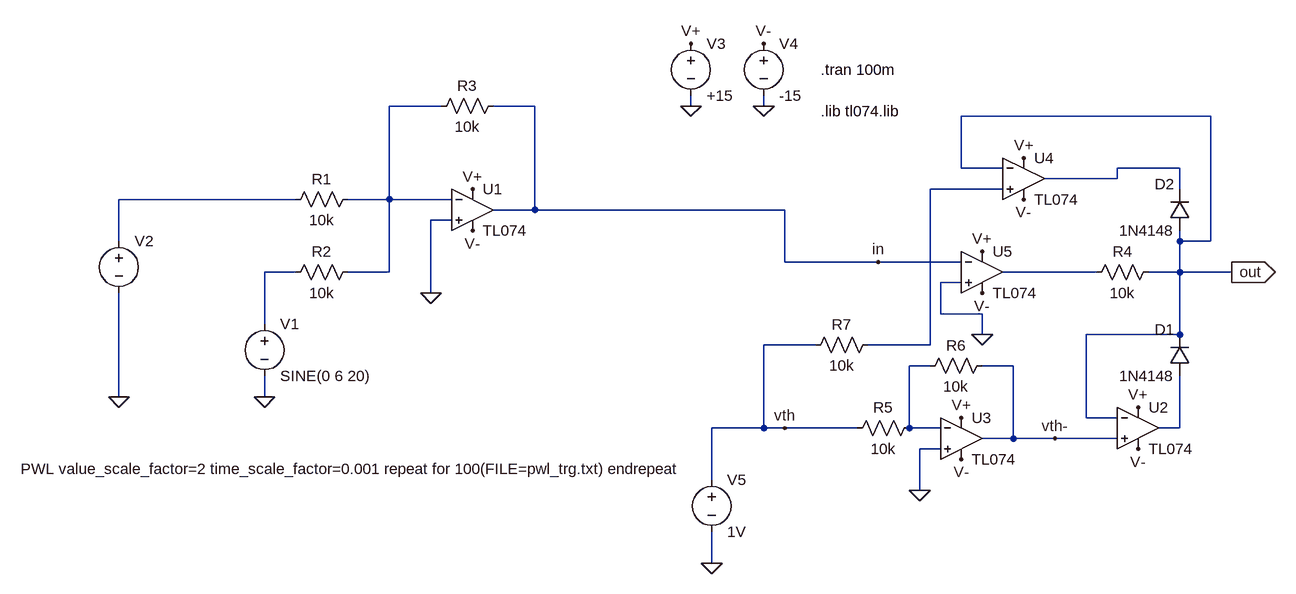
[diagram p0: schematic fig23Trg2VSinNoHys.asc]
fig23Trg2VSinNoHys.asc, the LTspice schematic file:
Version 4
SHEET 1 1216 728
WIRE -464 -96 -544 -96
WIRE -320 -96 -384 -96
WIRE -80 -96 -80 -112
WIRE 32 -96 32 -112
WIRE 720 -80 336 -80
WIRE 336 0 336 -80
WIRE 400 0 336 0
WIRE 672 0 576 0
WIRE 576 16 576 0
WIRE 576 16 464 16
WIRE 400 32 288 32
WIRE 672 32 672 0
WIRE -688 48 -960 48
WIRE -544 48 -544 -96
WIRE -544 48 -608 48
WIRE -448 48 -544 48
WIRE -320 64 -320 -96
WIRE -320 64 -384 64
WIRE 64 64 -320 64
WIRE -448 80 -480 80
WIRE -960 112 -960 48
WIRE 672 112 672 96
WIRE 720 112 720 -80
WIRE 720 112 672 112
WIRE 64 144 64 64
WIRE 208 144 64 144
WIRE 336 144 208 144
WIRE -688 160 -736 160
WIRE -544 160 -544 48
WIRE -544 160 -608 160
WIRE 544 160 400 160
WIRE 672 160 672 112
WIRE 672 160 624 160
WIRE 752 160 672 160
WIRE 336 176 304 176
WIRE -480 192 -480 80
WIRE 304 224 304 176
WIRE 368 224 304 224
WIRE -736 240 -736 160
WIRE 368 256 368 224
WIRE 672 256 672 160
WIRE 672 256 528 256
WIRE 112 272 32 272
WIRE 288 272 288 32
WIRE 288 272 192 272
WIRE 288 304 256 304
WIRE 416 304 368 304
WIRE -960 352 -960 192
WIRE -736 352 -736 320
WIRE 528 384 528 256
WIRE 576 384 528 384
WIRE 32 400 32 272
WIRE 32 400 -48 400
WIRE 64 400 32 400
WIRE 176 400 64 400
WIRE 256 400 256 304
WIRE 304 400 256 400
WIRE 672 400 672 320
WIRE 672 400 640 400
WIRE 416 416 416 304
WIRE 416 416 368 416
WIRE 480 416 416 416
WIRE 576 416 480 416
WIRE 304 432 272 432
WIRE -48 480 -48 400
WIRE 272 496 272 432
WIRE -48 608 -48 560
FLAG -736 352 0
FLAG 272 496 0
FLAG 752 160 out
IOPIN 752 160 Out
FLAG -80 -96 0
FLAG 32 -96 0
FLAG -80 -192 V+
FLAG 32 -192 V-
FLAG 608 368 V+
FLAG 608 432 V-
FLAG -48 608 0
FLAG 208 144 in
FLAG 64 400 vth
FLAG 480 416 vth-
FLAG 336 384 V+
FLAG 368 128 V+
FLAG 432 -16 V+
FLAG 432 48 V-
FLAG 368 192 V-
FLAG 336 448 V-
FLAG -416 32 V+
FLAG -416 96 V-
FLAG -480 192 0
FLAG -960 352 0
FLAG 368 256 0
SYMBOL res 528 176 R270
WINDOW 0 32 56 VTop 0
WINDOW 3 0 56 VBottom 0
SYMATTR InstName R4
SYMATTR Value 10k
SYMBOL voltage -960 96 R0
WINDOW 123 0 0 Left 0
WINDOW 39 0 0 Left 0
WINDOW 3 -151 367 Left 0
SYMATTR Value PWL value_scale_factor=2 time_scale_factor=0.001 repeat for 100(FILE=pwl_trg.txt) endrepeat
SYMATTR InstName V2
SYMBOL diode 688 320 R180
WINDOW 0 24 72 Left 0
WINDOW 3 24 0 Left 0
SYMATTR InstName D1
SYMATTR Value 1N4148
SYMBOL voltage -80 -208 R0
SYMATTR InstName V3
SYMATTR Value +15
SYMBOL voltage 32 -208 R0
SYMATTR InstName V4
SYMATTR Value -15
SYMBOL Opamps\\opamp2 608 336 R0
SYMATTR InstName U2
SYMATTR Value TL074
SYMBOL voltage -48 464 R0
WINDOW 123 0 0 Left 0
WINDOW 39 0 0 Left 0
SYMATTR InstName V5
SYMATTR Value 1V
SYMBOL Opamps\\opamp2 336 352 R0
SYMATTR InstName U3
SYMATTR Value TL074
SYMBOL Opamps\\opamp2 432 -48 R0
SYMATTR InstName U4
SYMATTR Value TL074
SYMBOL Opamps\\opamp2 368 96 R0
SYMATTR InstName U5
SYMATTR Value TL074
SYMBOL res 160 416 R270
WINDOW 0 32 56 VTop 0
WINDOW 3 0 56 VBottom 0
SYMATTR InstName R5
SYMATTR Value 10k
SYMBOL res 272 320 R270
WINDOW 0 32 56 VTop 0
WINDOW 3 0 56 VBottom 0
SYMATTR InstName R6
SYMATTR Value 10k
SYMBOL res 96 288 R270
WINDOW 0 32 56 VTop 0
WINDOW 3 0 56 VBottom 0
SYMATTR InstName R7
SYMATTR Value 10k
SYMBOL diode 688 96 R180
WINDOW 0 24 72 Left 0
WINDOW 3 24 0 Left 0
SYMATTR InstName D2
SYMATTR Value 1N4148
SYMBOL voltage -736 224 R0
WINDOW 123 0 0 Left 0
WINDOW 39 0 0 Left 0
SYMATTR InstName V1
SYMATTR Value SINE(0 6 20)
SYMBOL Opamps\\opamp2 -416 0 R0
SYMATTR InstName U1
SYMATTR Value TL074
SYMBOL res -704 64 R270
WINDOW 0 32 56 VTop 0
WINDOW 3 0 56 VBottom 0
SYMATTR InstName R1
SYMATTR Value 10k
SYMBOL res -704 176 R270
WINDOW 0 32 56 VTop 0
WINDOW 3 0 56 VBottom 0
SYMATTR InstName R2
SYMATTR Value 10k
SYMBOL res -480 -80 R270
WINDOW 0 32 56 VTop 0
WINDOW 3 0 56 VBottom 0
SYMATTR InstName R3
SYMATTR Value 10k
TEXT 120 -88 Left 0 !.lib tl074.lib
TEXT 120 -152 Left 0 !.tran 100m

The netlist it stands for:
* fig23Trg2VSinNoHys.asc
R4 N006 out 10k
V2 N004 0 PWL value_scale_factor=2 time_scale_factor=0.001 repeat for 100(FILE=pwl_trg.txt) endrepeat
D1 N008 out 1N4148
V3 V+ 0 +15
V4 V- 0 -15
XU2 vth- out V+ V- N008 TL074  ; pins In+ In- V+ V- OUT
V5 vth 0 1V
XU3 0 N007 V+ V- vth- TL074  ; pins In+ In- V+ V- OUT
XU4 N003 out V+ V- N002 TL074  ; pins In+ In- V+ V- OUT
XU5 0 in V+ V- N006 TL074  ; pins In+ In- V+ V- OUT
R5 vth N007 10k
R6 N007 vth- 10k
R7 vth N003 10k
D2 out N002 1N4148
V1 N005 0 SINE(0 6 20)
XU1 0 N001 V+ V- in TL074  ; pins In+ In- V+ V- OUT
R1 N004 N001 10k
R2 N005 N001 10k
R3 N001 in 10k
.model D D
.lib standard.dio
.lib tl074.lib
.tran 100m
.backanno
.end